# Altium project CanSat OBC.PrjPcb
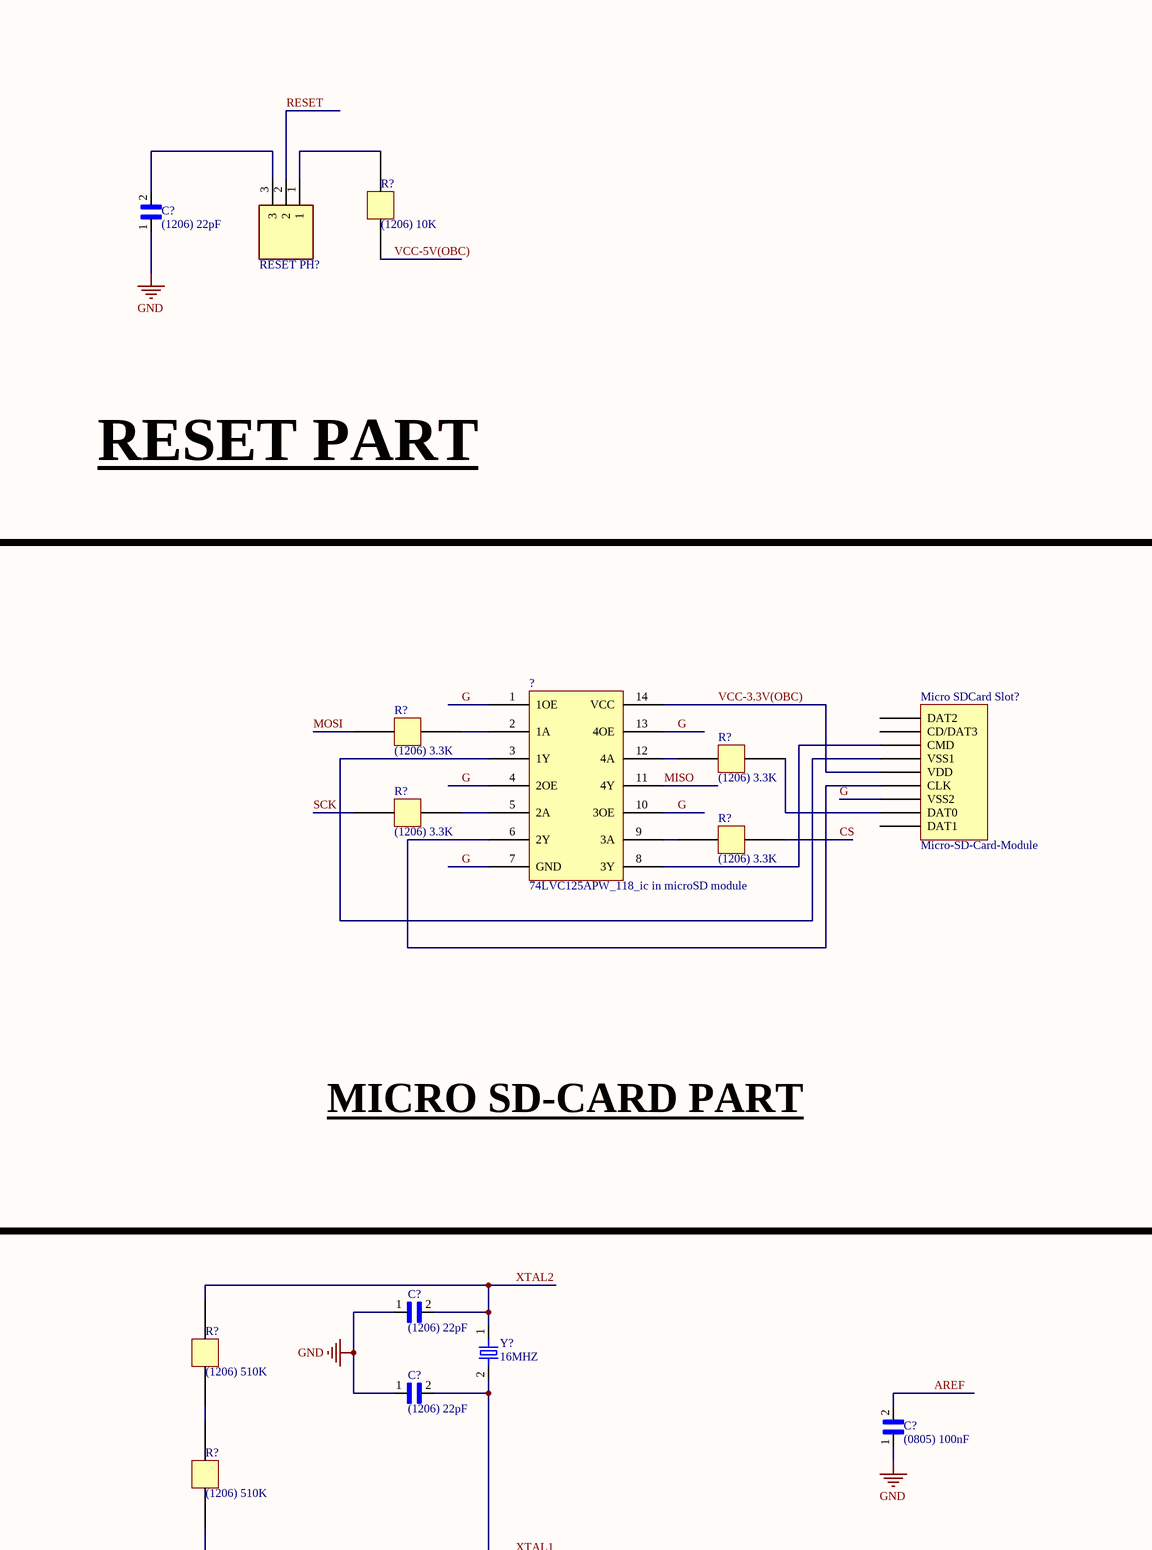
[diagram p0: CanSat OBC.SchDoc, top left]
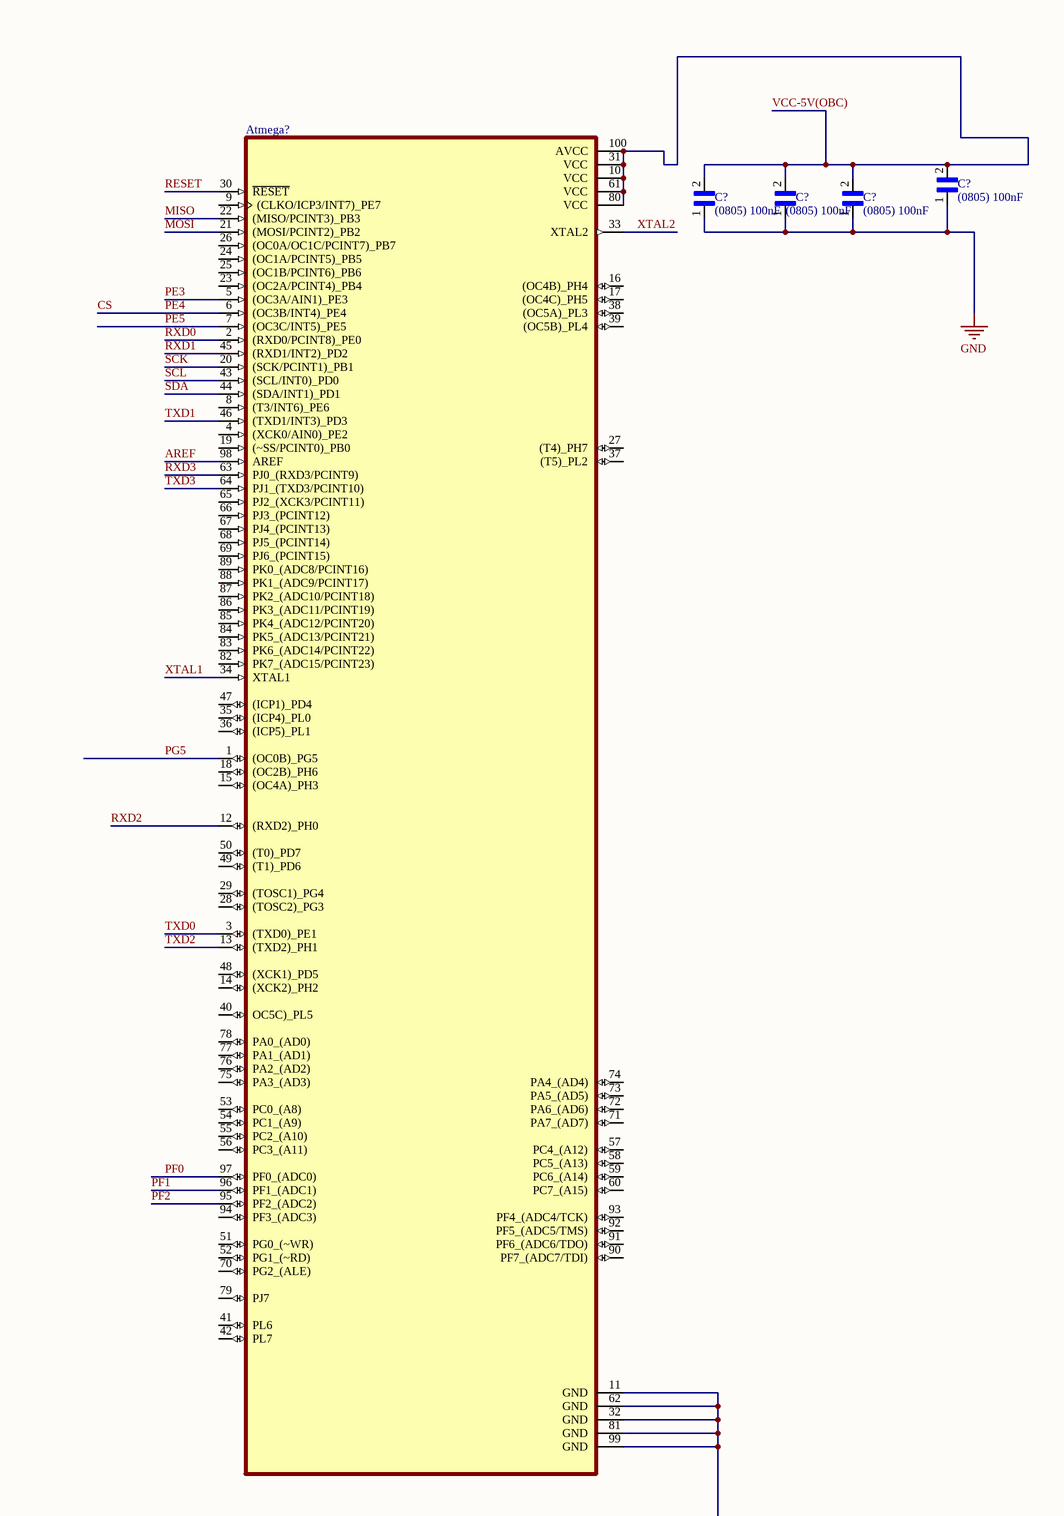
[diagram p1: CanSat OBC.SchDoc, top middle]
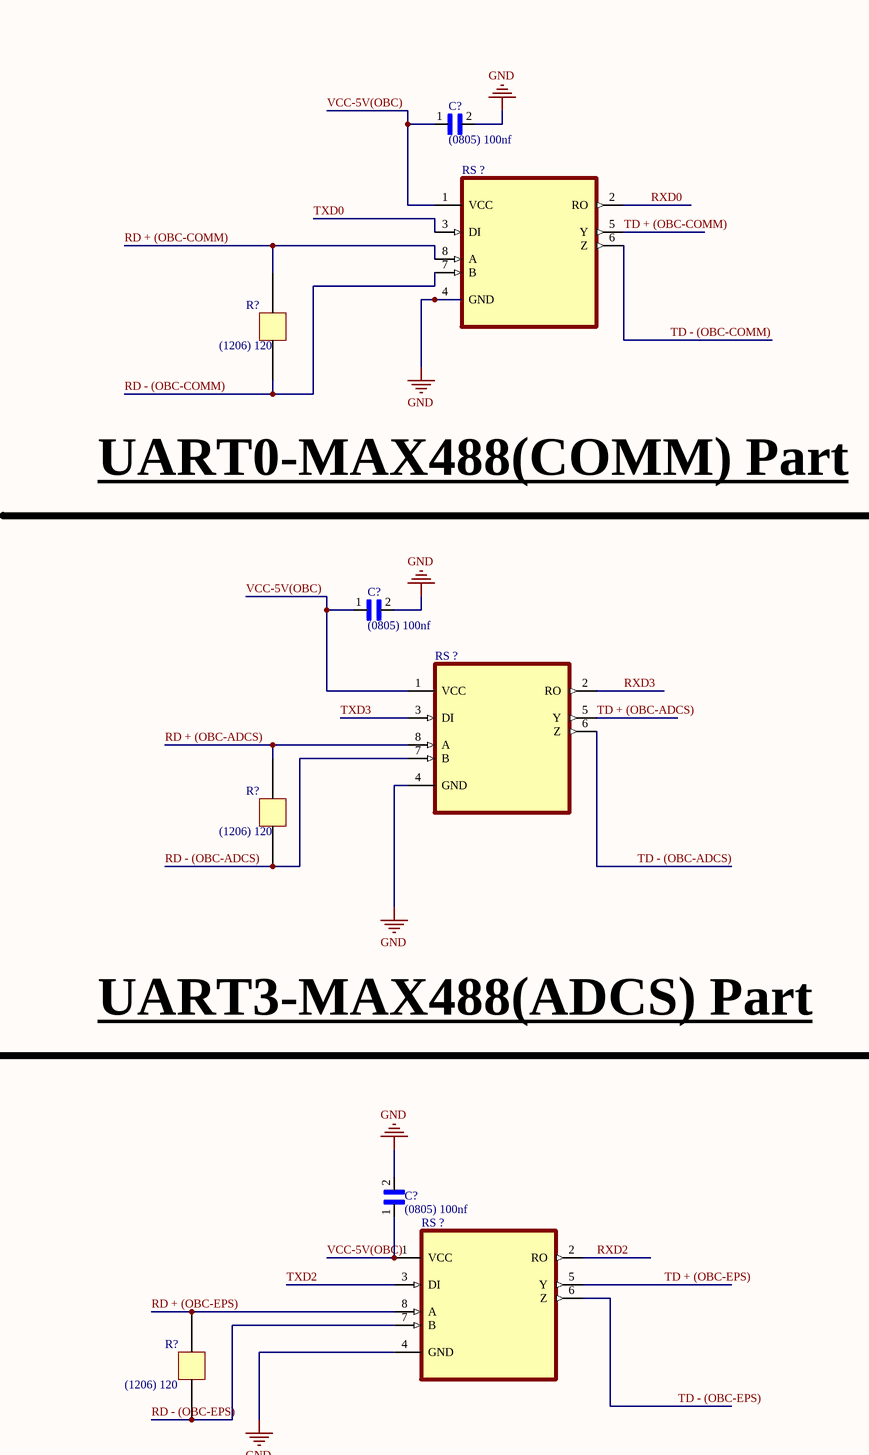
[diagram p2: CanSat OBC.SchDoc, top right]
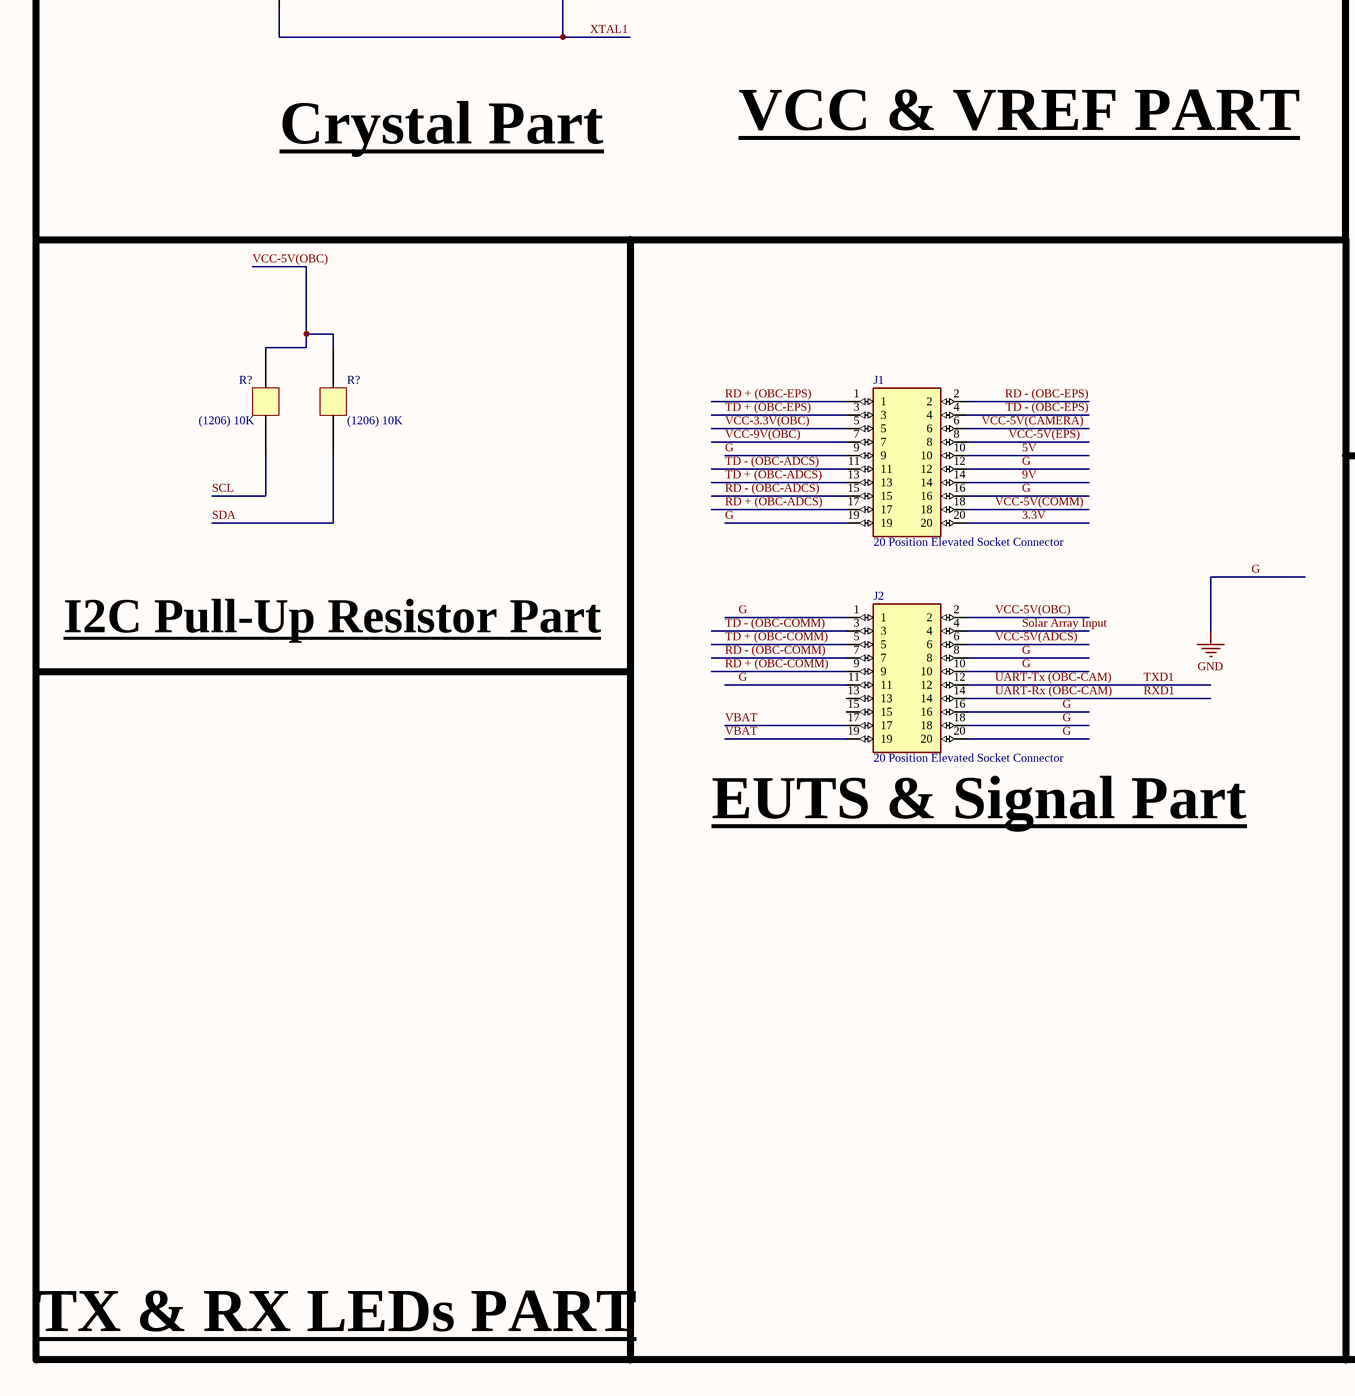
[diagram p3: CanSat OBC.SchDoc, bottom left]
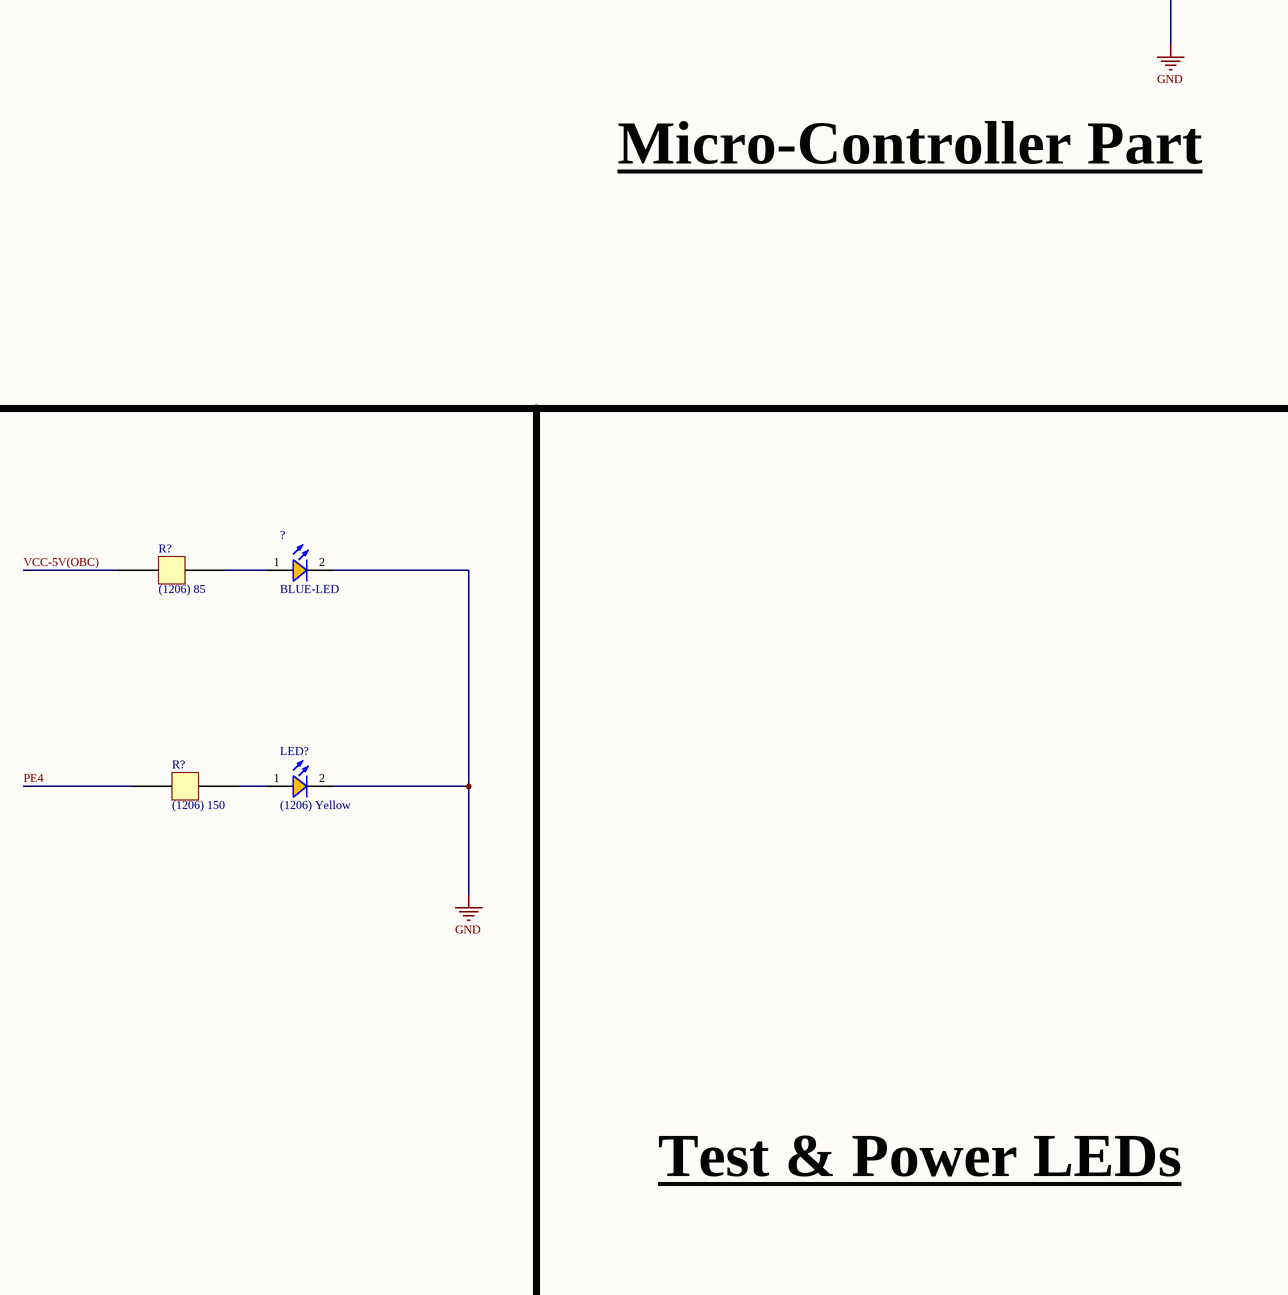
[diagram p4: CanSat OBC.SchDoc, bottom middle]
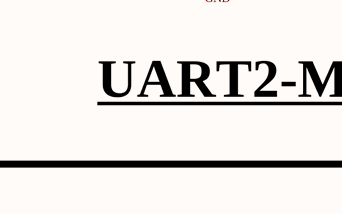
[diagram p5: CanSat OBC.SchDoc, bottom right]
1 sheet, 37 parts. Net scope: global (net labels, ports and power ports of the same name join across sheets).
Board file: CanSat OBC.PcbDoc

## Sheet CanSat OBC.SchDoc
size A1; SheetNumber: 1; SheetTotal: 1

### Parts
(Parts that share a designator on the sheet are numbered #1, #2 ... from top to bottom, then left to right.)
?#1  74LVC125APW_118_ic in microSD module  [SOP65P640X110-14N]
?#2  BLUE-LED  [RESC3015X65-01]
Atmega?  (no value)  [QFP50P1600X1600X120-100N]
C?#1  (0805) 100nf  [CAPC2012X95N-0]
C?#2  (1206) 22pF  [CAPC3216X125N0]
C?#3  (0805) 100nF  [CAPC2012X95N-0]
C?#4  (0805) 100nF  [CAPC2012X95N-0]
C?#5  (0805) 100nF  [CAPC2012X95N-0]
C?#6  (0805) 100nF  [CAPC2012X95N-0]
C?#7  (0805) 100nf  [CAPC2012X95N-0]
C?#8  (0805) 100nf  [CAPC2012X95N-0]
C?#9  (1206) 22pF  [CAPC3216X125N0]
C?#10  (1206) 22pF  [CAPC3216X125N0]
C?#11  (0805) 100nF  [CAPC2012X95N-0]
J1  20 Position Elevated Socket Connector  [ESQ-110-XX-X-D]
J2  20 Position Elevated Socket Connector  [ESQ-110-XX-X-D]
LED?  (1206) Yellow  [RESC3015X65-01]
Micro_SDCard_Slot?  Micro-SD-Card-Module  [SD-Card-Module]
R?#1  (1206) 10K  [CAPC3216X125N0]
R?#2  (1206) 120  [CAPC3216X125N0]
R?#3  (1206) 3.3K  [CAPC3216X125N0]
R?#4  (1206) 3.3K  [CAPC3216X125N0]
R?#5  (1206) 120  [CAPC3216X125N0]
R?#6  (1206) 3.3K  [CAPC3216X125N0]
R?#7  (1206) 3.3K  [CAPC3216X125N0]
R?#8  (1206) 120  [CAPC3216X125N0]
R?#9  (1206) 510K  [CAPC3216X125N0]
R?#10  (1206) 510K  [CAPC3216X125N0]
R?#11  (1206) 10K  [CAPC3216X125N0]
R?#12  (1206) 10K  [CAPC3216X125N0]
R?#13  (1206) 85  [CAPC3216X125N0]
R?#14  (1206) 150  [CAPC3216X125N0]
RESET_PH?  3 Position PinHeader 1Row  [TE_3-103327-3]  (value not drawn)
RS_?#1  (no value)  [SOIC127P600X175-8N0]
RS_?#2  (no value)  [SOIC127P600X175-8N0]
RS_?#3  (no value)  [SOIC127P600X175-8N0]
Y?  16MHZ  [XTAL1140X490X430N-0]

### Nets
G: ?#1.1(1OE) ?#1.4(2OE) ?#1.7(GND) ?#1.10(3OE) ?#1.13(4OE) ?#2.2(K) Atmega?.11(GND) Atmega?.32(GND) Atmega?.62(GND) Atmega?.81(GND) Atmega?.99(GND) C?#1.2 C?#2.1 C?#3.1 C?#4.1 C?#5.1 C?#6.1 C?#7.2 C?#8.2 C?#9.1 C?#10.1 C?#11.1 J1.9 J1.12 J1.16 J1.19 J2.1 J2.8 J2.10 J2.11 J2.16 J2.18 J2.20 LED?.2(K) Micro_SDCard_Slot?.6(VSS2) RS_?#1.4(GND) RS_?#2.4(GND) RS_?#3.4(GND)  [also labelled GND]
3.3V: J1.20
5V: J1.10
9V: J1.14
AREF: Atmega?.98(AREF) C?#11.2
CS: Atmega?.6((OC3B/INT4)_PE4) R?#7.2 R?#14.1  [also labelled PE4]
MISO: ?#1.11(4Y) Atmega?.22((MISO/PCINT3)_PB3)
MOSI: Atmega?.21((MOSI/PCINT2)_PB2) R?#3.1
PE3: Atmega?.5((OC3A/AIN1)_PE3)
PE5: Atmega?.7((OC3C/INT5)_PE5)
PF0: Atmega?.97(PF0_(ADC0))
PF1: Atmega?.96(PF1_(ADC1))
PF2: Atmega?.95(PF2_(ADC2))
PG5: Atmega?.1((OC0B)_PG5)
RD + (OBC-ADCS): J1.17 R?#5.2 RS_?#2.8(A)
RD + (OBC-COMM): J2.9 R?#2.2 RS_?#1.8(A)
RD + (OBC-EPS): J1.1 R?#8.2 RS_?#3.8(A)
RD - (OBC-ADCS): J1.15 R?#5.1 RS_?#2.7(B)
RD - (OBC-COMM): J2.7 R?#2.1 RS_?#1.7(B)
RD - (OBC-EPS): J1.2 R?#8.1 RS_?#3.7(B)
RESET: Atmega?.30(~{RESET}) RESET_PH?.2
RXD0: Atmega?.2((RXD0/PCINT8)_PE0) RS_?#1.2(RO)
RXD1: Atmega?.45((RXD1/INT2)_PD2) J2.14  [also labelled UART-Rx (OBC-CAM)]
RXD2: Atmega?.12((RXD2)_PH0) RS_?#3.2(RO)
RXD3: Atmega?.63(PJ0_(RXD3/PCINT9)) RS_?#2.2(RO)
SCK: Atmega?.20((SCK/PCINT1)_PB1) R?#6.1
SCL: Atmega?.43((SCL/INT0)_PD0) R?#11.2
SDA: Atmega?.44((SDA/INT1)_PD1) R?#12.2
Solar Array Input: J2.4
TD + (OBC-ADCS): J1.13 RS_?#2.5(Y)
TD + (OBC-COMM): J2.5 RS_?#1.5(Y)
TD + (OBC-EPS): J1.3 RS_?#3.5(Y)
TD - (OBC-ADCS): J1.11 RS_?#2.6(Z)
TD - (OBC-COMM): J2.3 RS_?#1.6(Z)
TD - (OBC-EPS): J1.4 RS_?#3.6(Z)
TXD0: Atmega?.3((TXD0)_PE1) RS_?#1.3(DI)
TXD1: Atmega?.46((TXD1/INT3)_PD3) J2.12  [also labelled UART-Tx (OBC-CAM)]
TXD2: Atmega?.13((TXD2)_PH1) RS_?#3.3(DI)
TXD3: Atmega?.64(PJ1_(TXD3/PCINT10)) RS_?#2.3(DI)
VBAT: J2.17 J2.19
VCC-3.3V(OBC): ?#1.14(VCC) J1.5 Micro_SDCard_Slot?.4(VDD)
VCC-5V(ADCS): J2.6
VCC-5V(CAMERA): J1.6
VCC-5V(COMM): J1.18
VCC-5V(EPS): J1.8
VCC-5V(OBC): Atmega?.10(VCC) Atmega?.31(VCC) Atmega?.61(VCC) Atmega?.80(VCC) Atmega?.100(AVCC) C?#1.1 C?#3.2 C?#4.2 C?#5.2 C?#6.2 C?#7.1 C?#8.1 J2.2 R?#1.1 R?#11.1 R?#12.1 R?#13.1 RS_?#1.1(VCC) RS_?#2.1(VCC) RS_?#3.1(VCC)
VCC-9V(OBC): J1.7
XTAL1: Atmega?.34(XTAL1) C?#10.2 R?#10.1 Y?.2
XTAL2: Atmega?.33(XTAL2) C?#9.2 R?#9.2 Y?.1
Net?#1_2: ?#1.2(1A) R?#3.2
Net?#1_3: ?#1.3(1Y) Micro_SDCard_Slot?.3(VSS1)
Net?#1_5: ?#1.5(2A) R?#6.2
Net?#1_6: ?#1.6(2Y) Micro_SDCard_Slot?.5(CLK)
Net?#1_8: ?#1.8(3Y) Micro_SDCard_Slot?.2(CMD)
Net?#1_9: ?#1.9(3A) R?#7.1
Net?#1_12: ?#1.12(4A) R?#4.1
Net?#2_1: ?#2.1(A) R?#13.2
NetC?#2_2: C?#2.2 RESET_PH?.3
NetLED?_1: LED?.1(A) R?#14.2
NetMicro_SDCard_Slot?_7: Micro_SDCard_Slot?.7(DAT0) R?#4.2
NetR?#1_2: R?#1.2 RESET_PH?.1
NetR?#9_1: R?#9.1 R?#10.2

Not connected (* = marked no-connect by the designer): Atmega? 4((XCK0/AIN0)_PE2) 8((T3/INT6)_PE6) 9((CLKO/ICP3/INT7)_PE7) 14((XCK2)_PH2) 15((OC4A)_PH3) 16((OC4B)_PH4) 17((OC4C)_PH5) 18((OC2B)_PH6) 19((~SS/PCINT0)_PB0) 23((OC2A/PCINT4)_PB4) 24((OC1A/PCINT5)_PB5) 25((OC1B/PCINT6)_PB6) 26((OC0A/OC1C/PCINT7)_PB7) 27((T4)_PH7) 28((TOSC2)_PG3) 29((TOSC1)_PG4) 35((ICP4)_PL0) 36((ICP5)_PL1) 37((T5)_PL2) 38((OC5A)_PL3) 39((OC5B)_PL4) 40(OC5C)_PL5) 41(PL6) 42(PL7) 47((ICP1)_PD4) 48((XCK1)_PD5) 49((T1)_PD6) 50((T0)_PD7) 51(PG0_(~WR)) 52(PG1_(~RD)) 53(PC0_(A8)) 54(PC1_(A9)) 55(PC2_(A10)) 56(PC3_(A11)) 57(PC4_(A12)) 58(PC5_(A13)) 59(PC6_(A14)) 60(PC7_(A15)) 65(PJ2_(XCK3/PCINT11)) 66(PJ3_(PCINT12)) 67(PJ4_(PCINT13)) 68(PJ5_(PCINT14)) 69(PJ6_(PCINT15)) 70(PG2_(ALE)) 71(PA7_(AD7)) 72(PA6_(AD6)) 73(PA5_(AD5)) 74(PA4_(AD4)) 75(PA3_(AD3)) 76(PA2_(AD2)) 77(PA1_(AD1)) 78(PA0_(AD0)) 79(PJ7) 82(PK7_(ADC15/PCINT23)) 83(PK6_(ADC14/PCINT22)) 84(PK5_(ADC13/PCINT21)) 85(PK4_(ADC12/PCINT20)) 86(PK3_(ADC11/PCINT19)) 87(PK2_(ADC10/PCINT18)) 88(PK1_(ADC9/PCINT17)) 89(PK0_(ADC8/PCINT16)) 90(PF7_(ADC7/TDI)) 91(PF6_(ADC6/TDO)) 92(PF5_(ADC5/TMS)) 93(PF4_(ADC4/TCK)) 94(PF3_(ADC3)); J2 13 15; Micro_SDCard_Slot? 1(CD/DAT3) 8(DAT1) 9(DAT2)

### Notes on the sheet
- RESET PART
- UART0-MAX488(COMM) Part
- UART3-MAX488(ADCS) Part
- MICRO SD-CARD PART
- UART2-MAX488(EPS) Part
- VCC & VREF PART
- Crystal Part
- Micro-Controller Part
- I2C Pull-Up Resistor Part
- (near J2) EUTS & Signal Part
- Test & Power LEDs
- TX & RX LEDs PART

### Library data of the parts
?#2 LED? = LED 1206: LED SMD 1206 High Quality Forward Voltage: 3.2 V / Brightness: 700 mcd; Manufacturer: Wurth Elektronik; Manufacturer Part Number: 150060AS75003; Chip Technology: AlInGaP; Dominant Wavelength: 605nm; Emitting Color: Amber; Forward Voltage: 2V; Luminous Intensity: 350mcd; Peak Wavelength: 610nm; Viewing Angle: 140°; ComponentLink1Description: Manufacturer Link; ComponentLink1URL: http://www.we-online.de; ComponentLink2Description: Datasheet; ComponentLink2URL: https://www.we-online.com/catalog/datasheet/150060AS75003.pdf; Height: 0.7mm; Length: 1.6mm; Mounting Technology: SMT; Operating Temperature max.: 100C; Operating Temperature min.: -40C; Packaging: Tape and Reel; Size: 0603; Width: 0.8mm
Atmega? = ATMEGA2560-16AU: Value: *; MP: ATMEGA2560-16AU; Package: None; Availability: Unavailable; Price: None
C?#1 C?#3-C?#8 C?#11 = Capacitor 0805: UMK212SD103KD-T/CAP CER 10000PF 50V 0805; Package: None; Price: None; Value: *; MP: UMK212SD103KD-T; Availability: Unavailable
C?#2 C?#9 C?#10 = Capacitor 1206: UMF316B7103KFHT/1206 Capacitor; Package: None; Price: None; Value: *; MP: UMF316B7103KFHT; Availability: Unavailable
J1 J2 = 20 Position Elevated Socket Connector: 20 Position Elevated Socket Connector Through Hole; MP: ESQ-110-14-T-D; MF: Samtec; Package: None; SnapEDA_Link: https://www.snapeda.com/parts/ESQ-110-14-T-D/Samtec%20Inc./view-part/786056/?ref=snap; Value: *; Availability: Unavailable; Price: None
R?#1-R?#14 = Resistor 1206
RESET_PH? = 3 Position PinHeader 1Row: Conn Unshrouded Header HDR 3 POS 2.54mm Solder ST Thru-Hole Carton; MF: TE Connectivity; MP: 4-103327-5; Package: None; Value: *; TE_purchase_URL: https://www.te.com/usa-en/product-4-103327-5.html?te_bu=Cor&te_type=disp&te_campaign=seda_glo_cor-seda-global-disp-prtnr-fy19-seda-model-bom-cta_sma-317_1&elqCampaignId=32493; Price: None; SnapEDA_Link: https://www.snapeda.com/parts/4-103327-5/TE%20Connectivity%20AMP%20Connectors/view-part/2403997/?ref=snap; Availability: Unavailable; EU_RoHS_Compliance: Compliant
RS_?#1-RS_?#3 = MAX488ESA+: 1/1 Transceiver Full RS422, RS485 8-SOIC; MP: MAX488ESA+T; MF: Maxim Integrated; Price: None; Package: SOIC-8 Maxim; Availability: Unavailable; SnapEDA_Link: https://www.snapeda.com/parts/MAX488ESA+T/Maxim%20Integrated/view-part/48834/?ref=snap; Value: *
Y? = Crystal 16MHZ